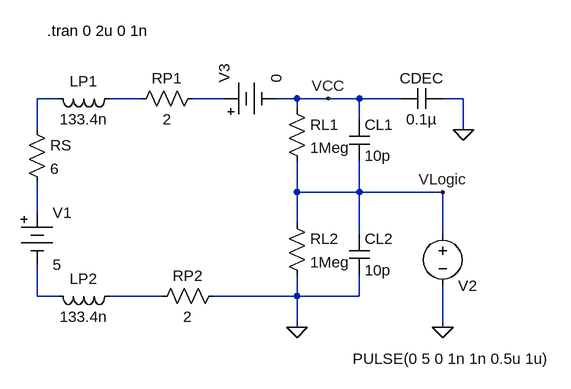
[diagram p0: schematic fig-02-04-15.asc]
fig-02-04-15.asc, the LTspice schematic file:
Version 4
SHEET 1 880 680
WIRE -160 48 -192 48
WIRE -32 48 -80 48
WIRE 96 48 48 48
WIRE 208 48 176 48
WIRE 256 48 208 48
WIRE 304 48 256 48
WIRE 368 48 304 48
WIRE 464 48 432 48
WIRE 208 64 208 48
WIRE 304 80 304 48
WIRE -192 96 -192 48
WIRE 464 96 464 48
WIRE 208 192 208 144
WIRE 304 192 304 144
WIRE 304 192 208 192
WIRE 432 192 304 192
WIRE -192 224 -192 176
WIRE 208 240 208 192
WIRE 304 256 304 192
WIRE 432 256 432 192
WIRE -192 352 -192 304
WIRE -160 352 -192 352
WIRE 0 352 -80 352
WIRE 208 352 208 320
WIRE 208 352 80 352
WIRE 304 352 304 320
WIRE 304 352 208 352
WIRE 208 400 208 352
WIRE 432 400 432 336
FLAG 208 400 0
FLAG 432 400 0
FLAG 464 96 0
FLAG 432 192 VLogic
FLAG 256 48 VCC
SYMBOL res 192 48 R0
SYMATTR InstName RL1
SYMATTR Value 1Meg
SYMBOL res 192 224 R0
SYMATTR InstName RL2
SYMATTR Value 1Meg
SYMBOL res 96 336 R90
WINDOW 0 0 56 VBottom 2
WINDOW 3 32 56 VTop 2
SYMATTR InstName RP2
SYMATTR Value 2
SYMBOL ind -64 336 R90
WINDOW 0 5 56 VBottom 2
WINDOW 3 32 56 VTop 2
SYMATTR InstName LP2
SYMATTR Value 133.4n
SYMBOL voltage 432 240 R0
WINDOW 0 24 96 Left 2
WINDOW 3 -138 208 Left 2
WINDOW 123 0 0 Left 0
WINDOW 39 0 0 Left 0
SYMATTR InstName V2
SYMATTR Value PULSE(0 5 0 1n 1n 0.5u 1u)
SYMBOL Misc\\battery -192 208 R0
WINDOW 123 0 0 Left 0
WINDOW 39 0 0 Left 0
SYMATTR InstName V1
SYMATTR Value 5
SYMBOL res 64 32 R90
WINDOW 0 0 56 VBottom 2
WINDOW 3 32 56 VTop 2
SYMATTR InstName RP1
SYMATTR Value 2
SYMBOL ind -64 32 R90
WINDOW 0 5 56 VBottom 2
WINDOW 3 32 56 VTop 2
SYMATTR InstName LP1
SYMATTR Value 133.4n
SYMBOL cap 288 80 R0
SYMATTR InstName CL1
SYMATTR Value 10p
SYMBOL cap 288 256 R0
SYMATTR InstName CL2
SYMATTR Value 10p
SYMBOL Misc\\battery 80 48 R270
WINDOW 123 0 0 Left 0
WINDOW 39 0 0 Left 0
SYMATTR InstName V3
SYMATTR Value 0
SYMBOL cap 432 32 R90
WINDOW 0 0 32 VBottom 2
WINDOW 3 32 32 VTop 2
SYMATTR InstName CDEC
SYMATTR Value 0.1µ
SYMBOL res -208 80 R0
SYMATTR InstName RS
SYMATTR Value 6
TEXT -176 -56 Left 2 !.tran 0 2u 0 1n

The netlist it stands for:
* fig-02-04-15.asc
RL1 VCC VLogic 1Meg
RL2 VLogic 0 1Meg
RP2 0 N006 2
LP2 N006 N005 133.4n
V2 VLogic 0 PULSE(0 5 0 1n 1n 0.5u 1u)
V1 N004 N005 5
RP1 N003 N002 2
LP1 N002 N001 133.4n
CL1 VCC VLogic 10p
CL2 VLogic 0 10p
V3 N003 VCC 0
CDEC 0 VCC 0.1µ
RS N001 N004 6
.tran 0 2u 0 1n
.backanno
.end